# EAGLE design keg-scale (EAGLE 9.6.2)
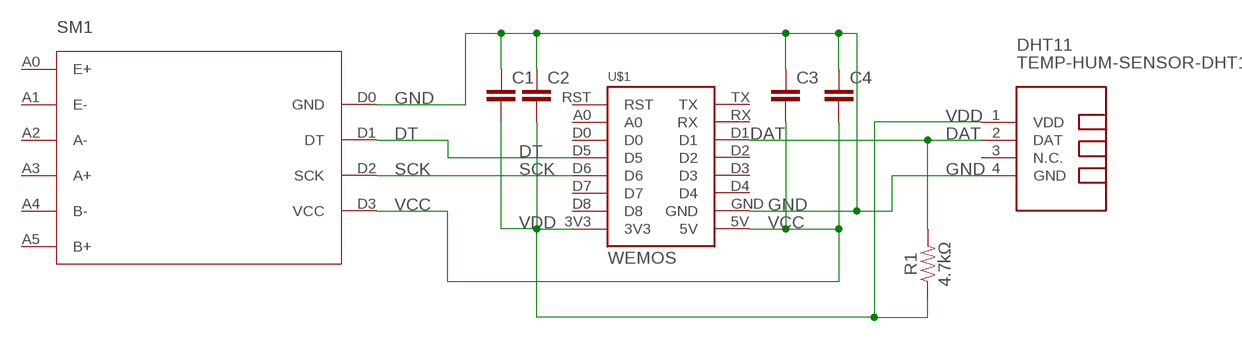
[diagram p0: schematic, sheet 1]

## Parts
C1  C5/3  [C5B3]
C2  C5/3  [C5B3]
C3  C5/3  [C5B3]
C4  C5/3  [C5B3]
DHT11  TEMP-HUM-SENSOR-DHT11  [TEMP-HUM-SENSOR-DHT11]
R1  4.7kΩ  RESISTORAXIAL-0.3  [AXIAL-0.3]
SM1  HX711  [HX711]
U$1  WEMOS  [WEMOS]

## Nets
DAT: DHT11.2(DAT) R1.P$2 U$1.D1
DT: SM1.D1(DT) U$1.D5
GND: C1.1 C2.1 C3.1 C4.1 DHT11.4(GND) SM1.D0(GND) U$1.GND
SCK: SM1.D2(SCK) U$1.D6
VCC: C3.2 C4.2 SM1.D3(VCC) U$1.5V
VDD: C1.2 C2.2 DHT11.1(VDD) R1.P$1 U$1.3V3
Unconnected: DHT11.3(N.C.) SM1.A0(E+) SM1.A1(E-) SM1.A2(A-) SM1.A3(A+) SM1.A4(B-) SM1.A5(B+) U$1.A0 U$1.D0 U$1.D2 U$1.D3 U$1.D4 U$1.D7 U$1.D8 U$1.RST U$1.RX U$1.TX

## Library data of the parts
C1-C4 = capacitor-wima:C: CAPACITOR naming: grid - package width
DHT11 = diy-modules:TEMP-HUM-SENSOR-DHT11: DHT11 - digital humidity & temperature sensor DHT11 datasheet available here: https://akizukidenshi.com/download/ds/aosong/DHT11.pdf Click here to find device on ebay.com <http://www.ebay.com/sch/dht11+digital+sensor>; URL: https://randomnerdtutorials.com/esp8266-dht11dht22-temperature-and-humidity-web-server-with-arduino-ide/
R1 = SparkFun-Resistors:RESISTOR: Generic Resistor Package
SM1 = hx711:HX711: HX711 module is a Load Cell Amplifier breakout board for the HX711 IC that allows you to easily read load cells to measure weight. This module uses 24 high precision A/D converter chip HX711. It is a specially designed for the high precision electronic scale design, with two analog input channel, the internal integration of 128 times the programmable gain amplifier. The input circuit can be configured to provide a bridge type pressure bridge (such as pressure, weighing sensor mode), is of high precision, low cost is an ideal sampling front-end module.; URL: https://how2electronics.com/iot-weighing-scale-hx711-load-cell-esp8266/
U$1 = Wemos:WEMOS

## Board
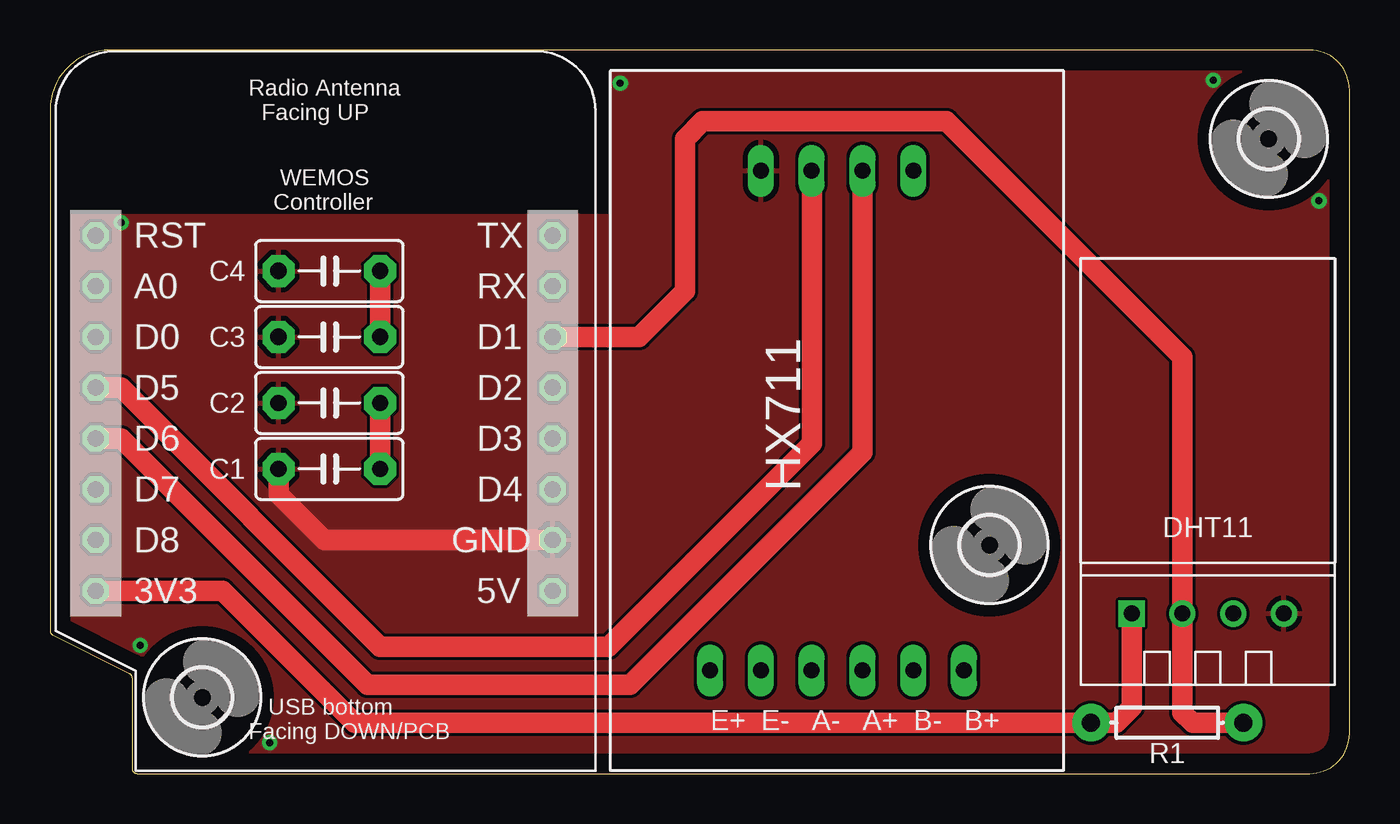
[diagram p1: board, top side]
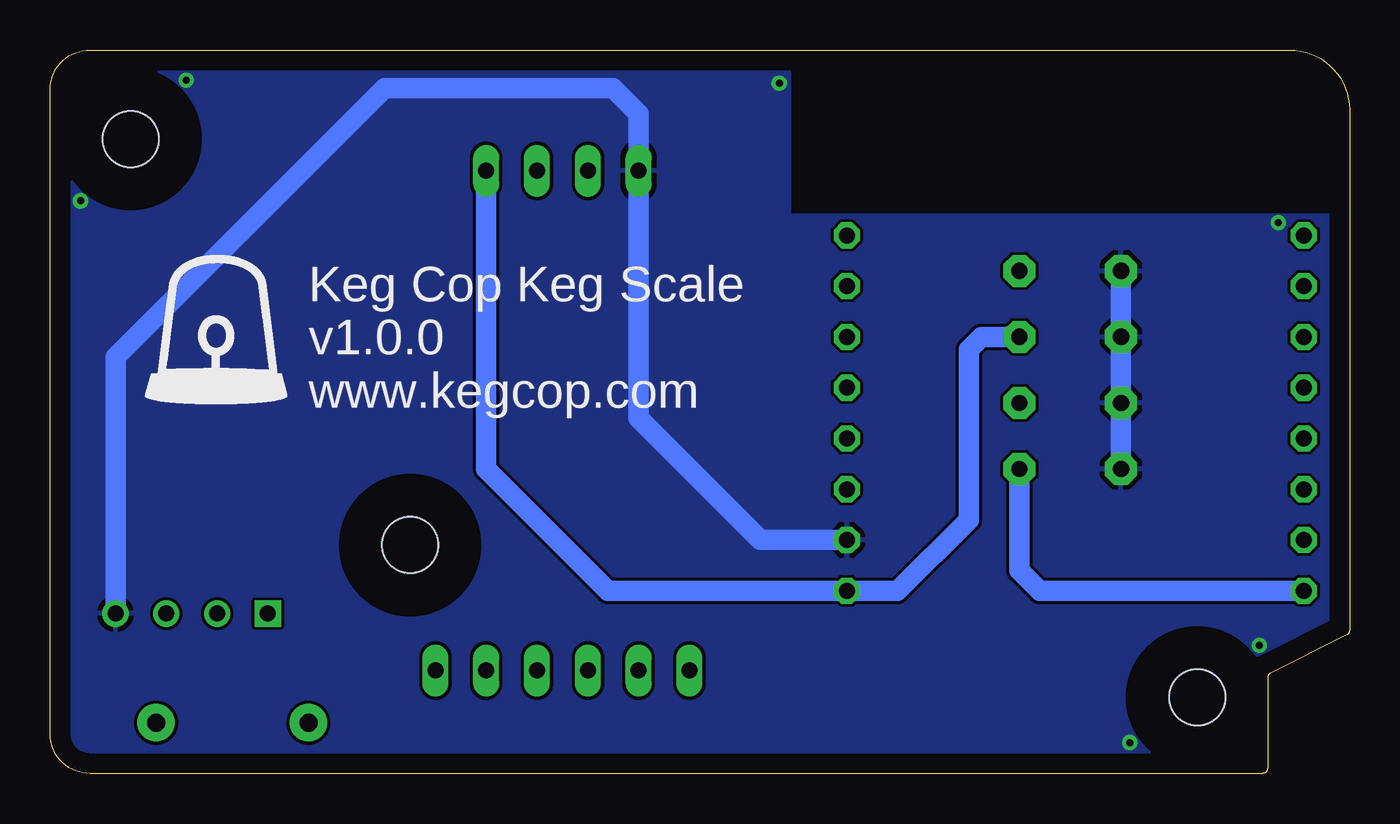
[diagram p2: board, bottom side, seen from below]

Size 65 x 36.2 mm. Coordinates in mm from the lower left corner, seen from the top.
Outline: 4.1,4.79 4.1,0.25 arc90 4.35,0 63,0 arc90 65,2 65,34.2 arc90 63,36.2 3,36.2 arc90 0,33.2 0,7.16 arc63 0.14,6.93 3.96,5.02 arc-63 4.1,4.79
Copper layers (1*16): Top 0.035mm / dielectric 1.5mm / Bottom 0.035mm
Design rules "default *": minimum track width 6mil, minimum drill 0.35mm, track to track 6mil, track to pad 6mil, pad to pad 6mil, via to via 6mil, smd to smd 6mil, copper to edge 40mil, drill to drill 6mil, minimum pad ring 10mil, minimum via ring 8mil, stop-mask expansion 4mil, vias tented up to drill 30mil, thermal gap 10mil

### Footprints (pad centres in the part's own frame; a part is rotated, then mirrored left to right if it is on the bottom)
C5B3 = drill 0.813 pad 1.6 octagon: 1 -2.54,0; 2 2.54,0
TEMP-HUM-SENSOR-DHT11 = drill 0.8 square: 1 -3.81,0 | drill 0.8: 2 -1.27,0; 3 1.27,0; 4 3.81,0
AXIAL-0.3 = drill 0.9 pad 1.88: P$1 -3.81,0; P$2 3.81,0
HX711 = drill 0.8 long: A0 -12.5,6.35; A1 -12.5,3.81; A2 -12.5,1.27; A3 -12.5,-1.27; A4 -12.5,-3.81; A5 -12.5,-6.35; D0 12.5,3.81; D1 12.5,1.27; D2 12.5,-1.27; D3 12.5,-3.81
WEMOS = drill 0.8 octagon: 3V3 0,0; 5V 22.86,0; A0 0,15.24; D0 0,12.7; D1 22.86,12.7; D2 22.86,10.16; D3 22.86,7.62; D4 22.86,5.08; D5 0,10.16; D6 0,7.62; D7 0,5.08; D8 0,2.54; GND 22.86,2.54; RST 0,17.78; RX 22.86,15.24; TX 22.86,17.78
2,8 = hole 2.8: 0,0

### Placement (x,y rotation side)
C1  13.97,15.24 0 top
C2  13.97,18.54 0 top
C3  13.97,21.84 0 top
C4  13.97,25.15 0 top
DHT11  57.91,8 0 top
R1  55.88,2.54 0 top
SM1  39.37,17.65 90 top
U$1  2.29,9.14 0 top
U$2  [2,8]  7.62,3.81 0 top
U$3  [2,8]  46.99,11.43 0 top
U$4  [2,8]  60.96,31.75 0 top

### Tracks (layer width: path | path; a pad name or v marks a point on that pad's centre or on a via)
DAT
  Top 1.016: R1.P$2 57.15,2.54 56.64,3.05 DHT11.2 56.64,20.83 44.83,32.64 32.64,32.64 31.75,31.75 31.75,24.13 29.46,21.84 U$1.D1
DT
  Top 1.016: U$1.D5 3.56,19.3 16.51,6.35 27.94,6.35 38.1,16.51 SM1.D1
GND  (via drill 0.35)
  Top 1.016: C1.1 11.43,13.97 13.72,11.68 U$1.GND
  Bottom 1.016: U$1.GND 29.46,11.68 35.56,17.78 SM1.D0 35.56,33.02 36.83,34.29 48.26,34.29 61.72,20.83 DHT11.4 | C1.1 C2.1 C3.1 C4.1
  other vias: 4.51,6.41 10.99,1.55 28.52,34.54 58.18,34.68 63.47,28.65 3.57,27.56
  pour Top: 0,27.94 28,27.94 28,36.2 61.34,36.2 65.02,32.51 65.02,0 6.86,0 4.06,2.79 4.06,4.95 0,7 0,9.14
  pour Bottom: 0,27.94 28,27.94 28,36.2 61.34,36.2 65.02,32.51 65.02,0 6.86,0 4.06,2.79 4.06,4.95 0,7
SCK
  Top 1.016: SM1.D2 40.64,16.07 29.01,4.45 15.88,4.45 3.56,16.76 U$1.D6
VCC
  Top 1.016: C3.2 C4.2
  Bottom 1.016: SM1.D3 43.18,15.24 37.08,9.14 U$1.5V 22.61,9.14 19.05,12.7 19.05,21.21 18.41,21.84 C3.2
VDD
  Top 1.016: U$1.3V3 8.64,9.14 15.24,2.54 R1.P$1 53.34,2.54 54.1,3.3 DHT11.1 | C1.2 C2.2
  Bottom 1.016: U$1.3V3 15.49,9.14 16.51,10.16 C1.2

### Text on the board
tNames: E+ | E- | A- | A+ | B- | B+
bNames: Keg Cop Keg Scale / v1.0.0 / www.kegcop.com